# Altium schematic sheet REVERSION_HISTORY.SchDoc: REVERSION_HISTORY
size A3; SheetNumber: 1; SheetTotal: 4; ProjectTitle: Module_Ethernet_W5500
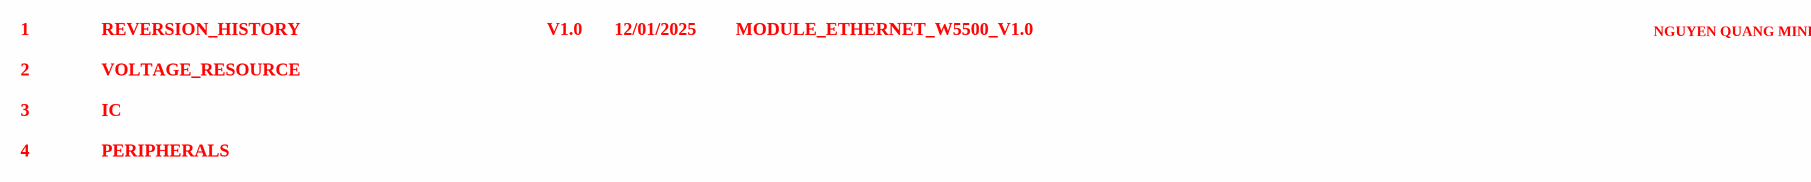
[diagram p0: REVERSION_HISTORY.SchDoc]

## Notes on the sheet
- 1
- REVERSION_HISTORY
- V1.0
- 12/01/2025
- MODULE_ETHERNET_W5500_V1.0
- NGUYEN QUANG MINH
- 2
- 3
- VOLTAGE_RESOURCE
- IC
- 4
- PERIPHERALS
- TABLES OF CONTENTS
- REVISION HISTORY
- PAGE
- CONTENTS
- VER#
- DATE
- REVISIONS
- DESCRIPTION OF CHANGES
- AUTHOR
- Author:
- Title:
- Size:
- A3
- Project:
- Revision:
- Modified Date:
- CheckedBy:
- Date:
- SW Version: